# EAGLE design pCog101_Wifi_Remote_BLED (EAGLE 6.6.0)

## Sheet 1 of 5
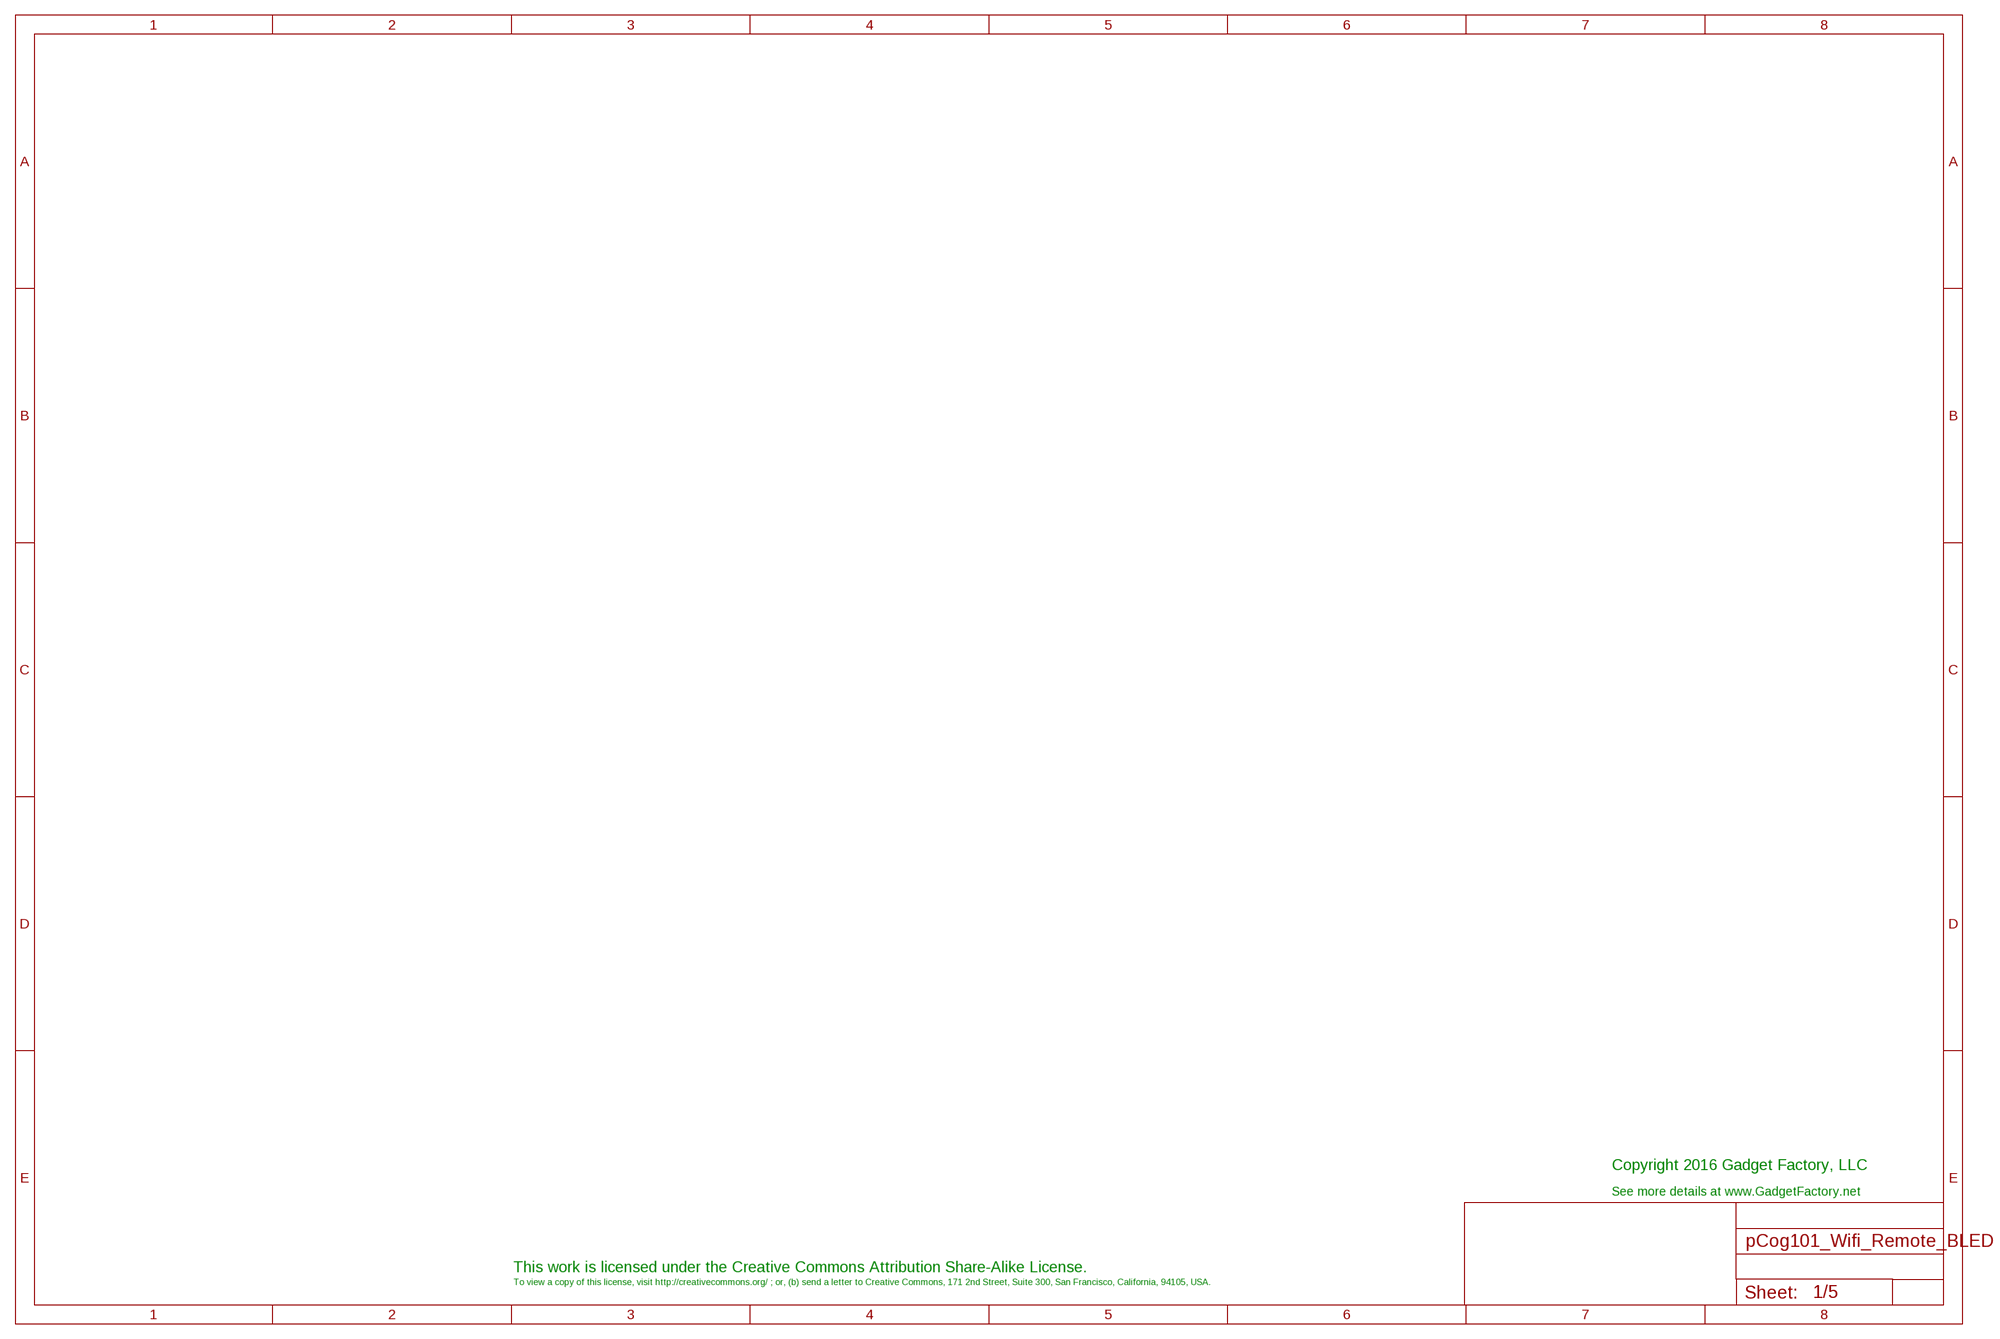
[diagram p0: schematic, sheet 1]

### Notes on the sheet
- Copyright 2016 Gadget Factory, LLC
- See more details at www.GadgetFactory.net
- This work is licensed under the Creative Commons Attribution Share-Alike License.
- To view a copy of this license, visit http://creativecommons.org/ ; or, (b) send a letter to Creative Commons, 171 2nd Street, Suite 300, San Francisco, California, 94105, USA.

## Sheet 2 of 5
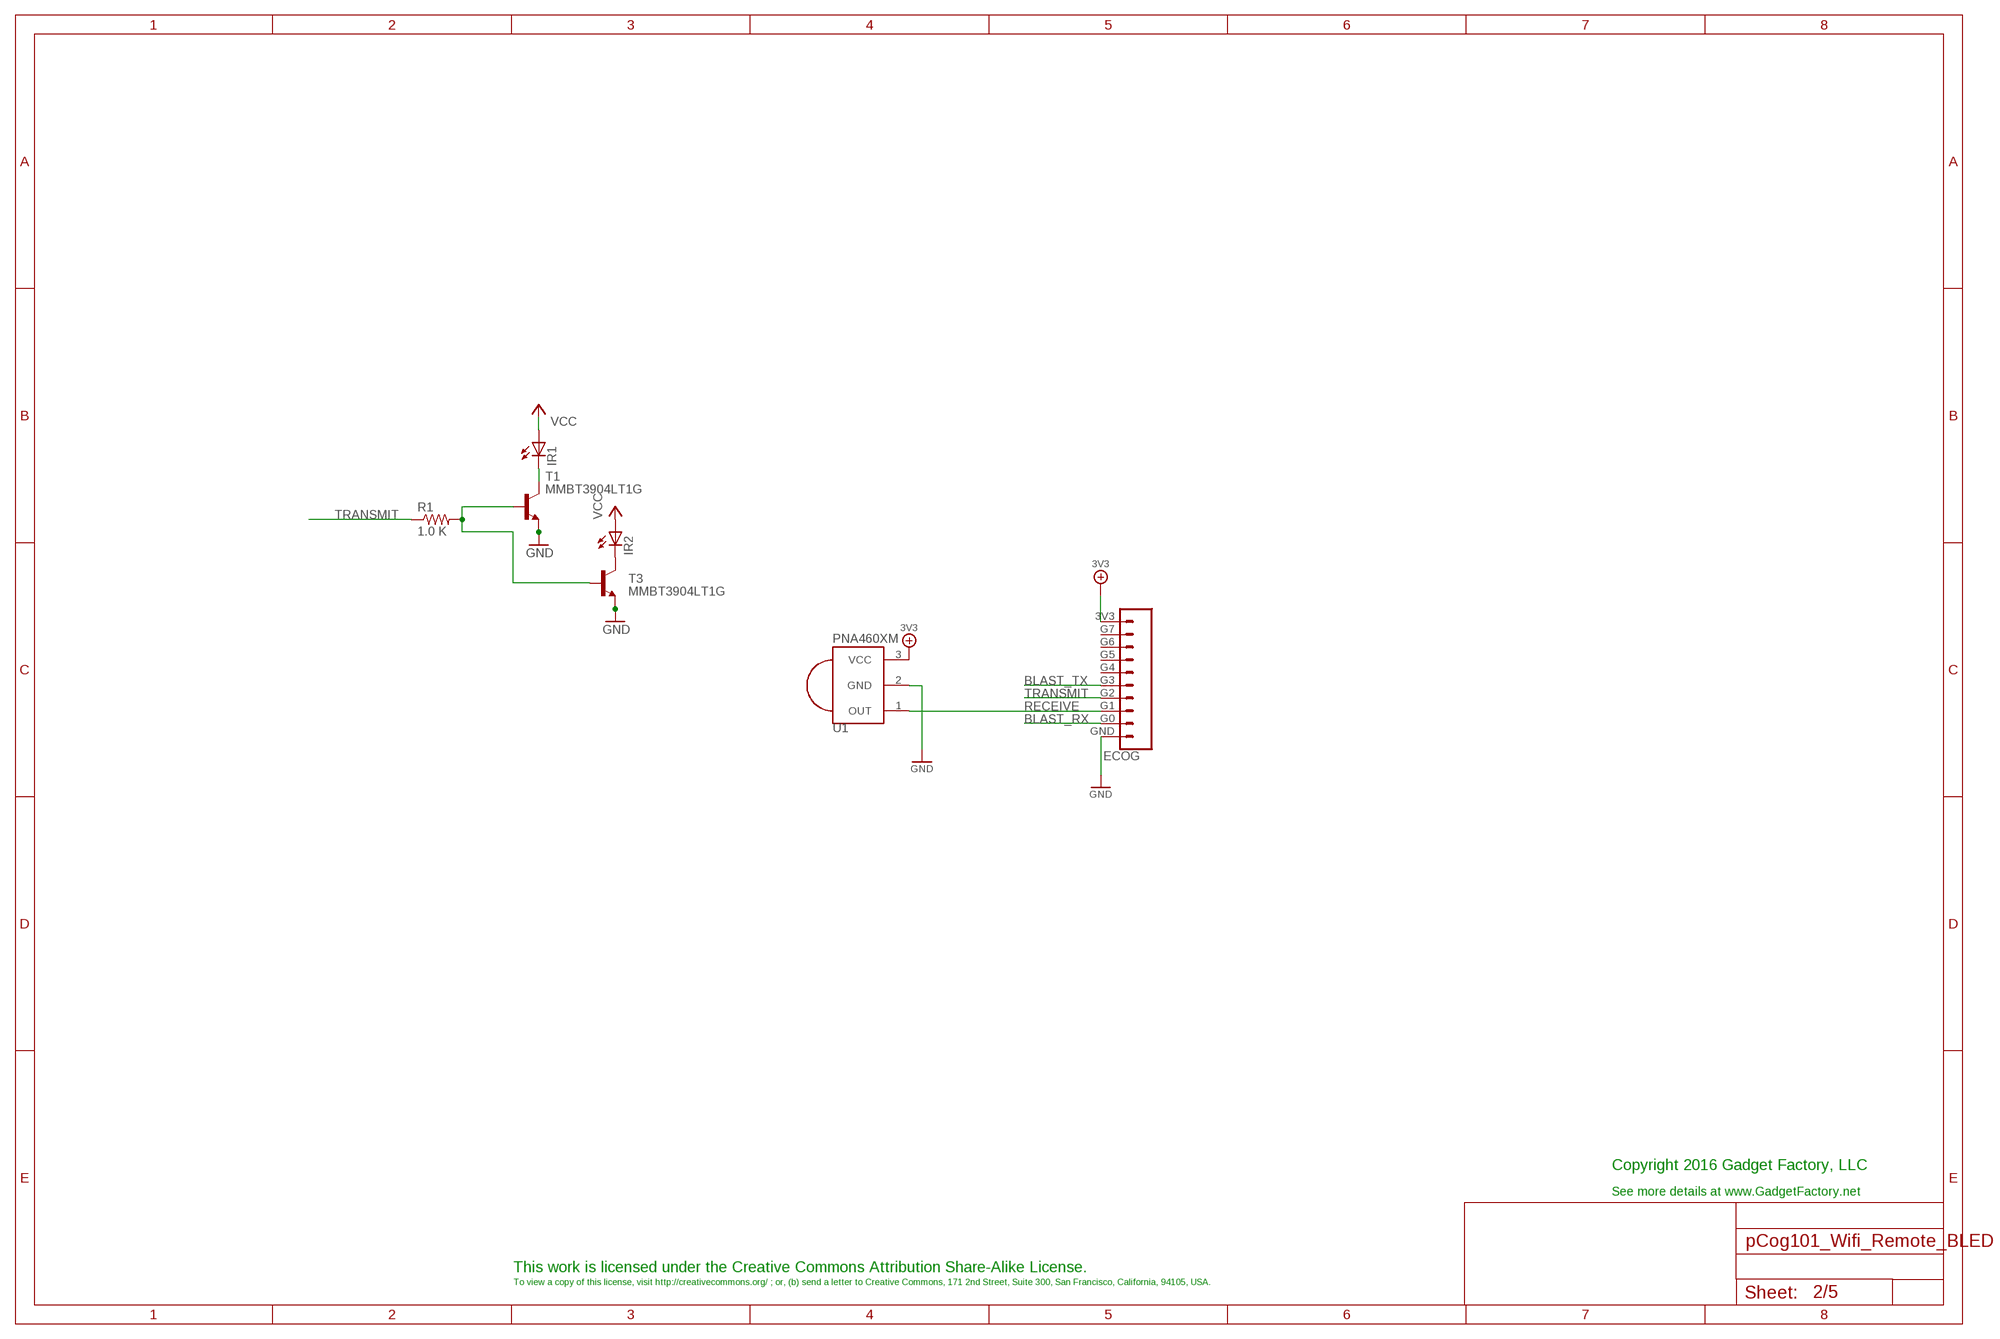
[diagram p1: schematic, sheet 2]

### Parts
ECOG  ECOG_GENERAL_ROWECOG_GENERAL_SMD  [ECOG_GENERAL_SMD]
IR1  LED5MM  [LED5MM]
IR2  LED5MM  [LED5MM]
R1  1.0 K  R-US_R0805  [R0805]
T1  MMBT3904LT1G  MMBT3904LT1-NPN-SOT23-BEC  [SOT23-BEC]
T3  MMBT3904LT1G  MMBT3904LT1-NPN-SOT23-BEC  [SOT23-BEC]
U1  PNA460XM  [PNA460XM]

### Nets
3V3: ECOG.3V3 IR1.A IR2.A U1.3(VCC) ; supply symbol labelled VCC ; also sheet 3,4,5
BLAST_RX: ECOG.G0
BLAST_TX: ECOG.G3
GND: ECOG.GND T1.E T3.E U1.2(GND) ; also sheet 3,4,5
N$7: IR1.K(C) T1.C
N$9: IR2.K(C) T3.C
N$10: R1.2 T1.B T3.B
RECEIVE: ECOG.G1 U1.1(OUT)
TRANSMIT: ECOG.G2 R1.1
Unconnected: ECOG.G4 ECOG.G5 ECOG.G6 ECOG.G7

### Notes on the sheet
- Copyright 2016 Gadget Factory, LLC
- See more details at www.GadgetFactory.net
- This work is licensed under the Creative Commons Attribution Share-Alike License.
- To view a copy of this license, visit http://creativecommons.org/ ; or, (b) send a letter to Creative Commons, 171 2nd Street, Suite 300, San Francisco, California, 94105, USA.

## Sheet 3 of 5
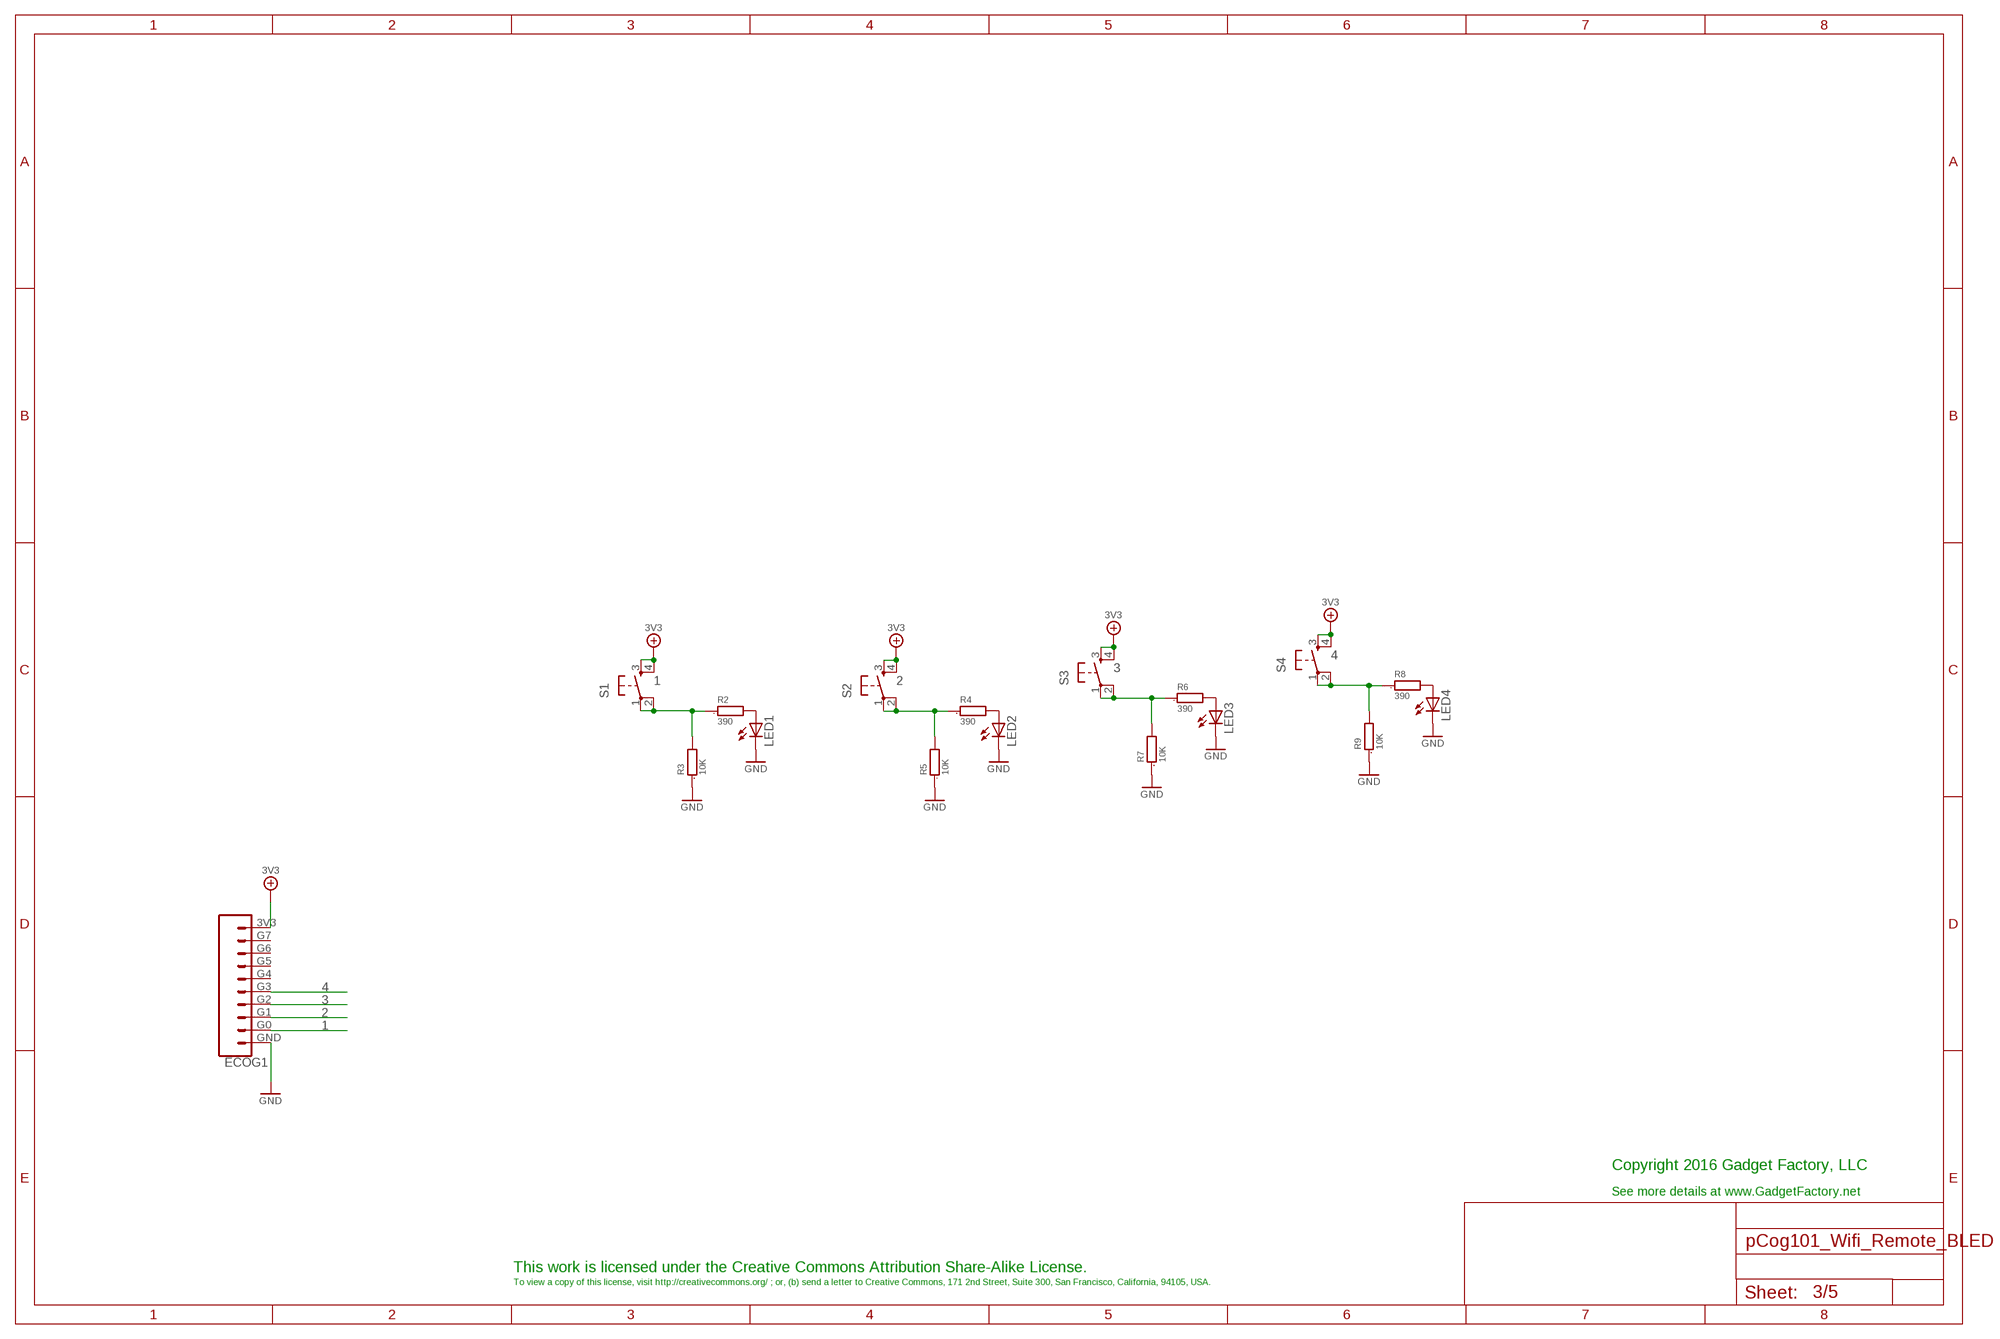
[diagram p2: schematic, sheet 3]

### Parts
ECOG1  ECOG_GENERAL_ROWECOG_GENERAL_SMD  [ECOG_GENERAL_SMD]
LED1  LEDCHIP-LED0805  [CHIP-LED0805]
LED2  LEDCHIP-LED0805  [CHIP-LED0805]
LED3  LEDCHIP-LED0805  [CHIP-LED0805]
LED4  LEDCHIP-LED0805  [CHIP-LED0805]
R2  390  R0805  [0805]
R3  10K  R0805  [0805]
R4  390  R0805  [0805]
R5  10K  R0805  [0805]
R6  390  R0805  [0805]
R7  10K  R0805  [0805]
R8  390  R0805  [0805]
R9  10K  R0805  [0805]
S1  TAC_SWITCHPTH  [TACTILE-PTH]
S2  TAC_SWITCHPTH  [TACTILE-PTH]
S3  TAC_SWITCHPTH  [TACTILE-PTH]
S4  TAC_SWITCHPTH  [TACTILE-PTH]

### Nets
1: ECOG1.G0 R2.1 R3.2 S1.1 S1.2
2: ECOG1.G1 R4.1 R5.2 S2.1 S2.2
3: ECOG1.G2 R6.1 R7.2 S3.1 S3.2
3V3: ECOG1.3V3 S1.3 S1.4 S2.3 S2.4 S3.3 S3.4 S4.3 S4.4 ; also sheet 2,4,5
4: ECOG1.G3 R8.1 R9.2 S4.1 S4.2
GND: ECOG1.GND LED1.C LED2.C LED3.C LED4.C R3.1 R5.1 R7.1 R9.1 ; also sheet 2,4,5
N$1: LED1.A R2.2
N$2: LED2.A R4.2
N$3: LED3.A R6.2
N$4: LED4.A R8.2
Unconnected: ECOG1.G4 ECOG1.G5 ECOG1.G6 ECOG1.G7

### Notes on the sheet
- Copyright 2016 Gadget Factory, LLC
- See more details at www.GadgetFactory.net
- This work is licensed under the Creative Commons Attribution Share-Alike License.
- To view a copy of this license, visit http://creativecommons.org/ ; or, (b) send a letter to Creative Commons, 171 2nd Street, Suite 300, San Francisco, California, 94105, USA.

## Sheet 4 of 5
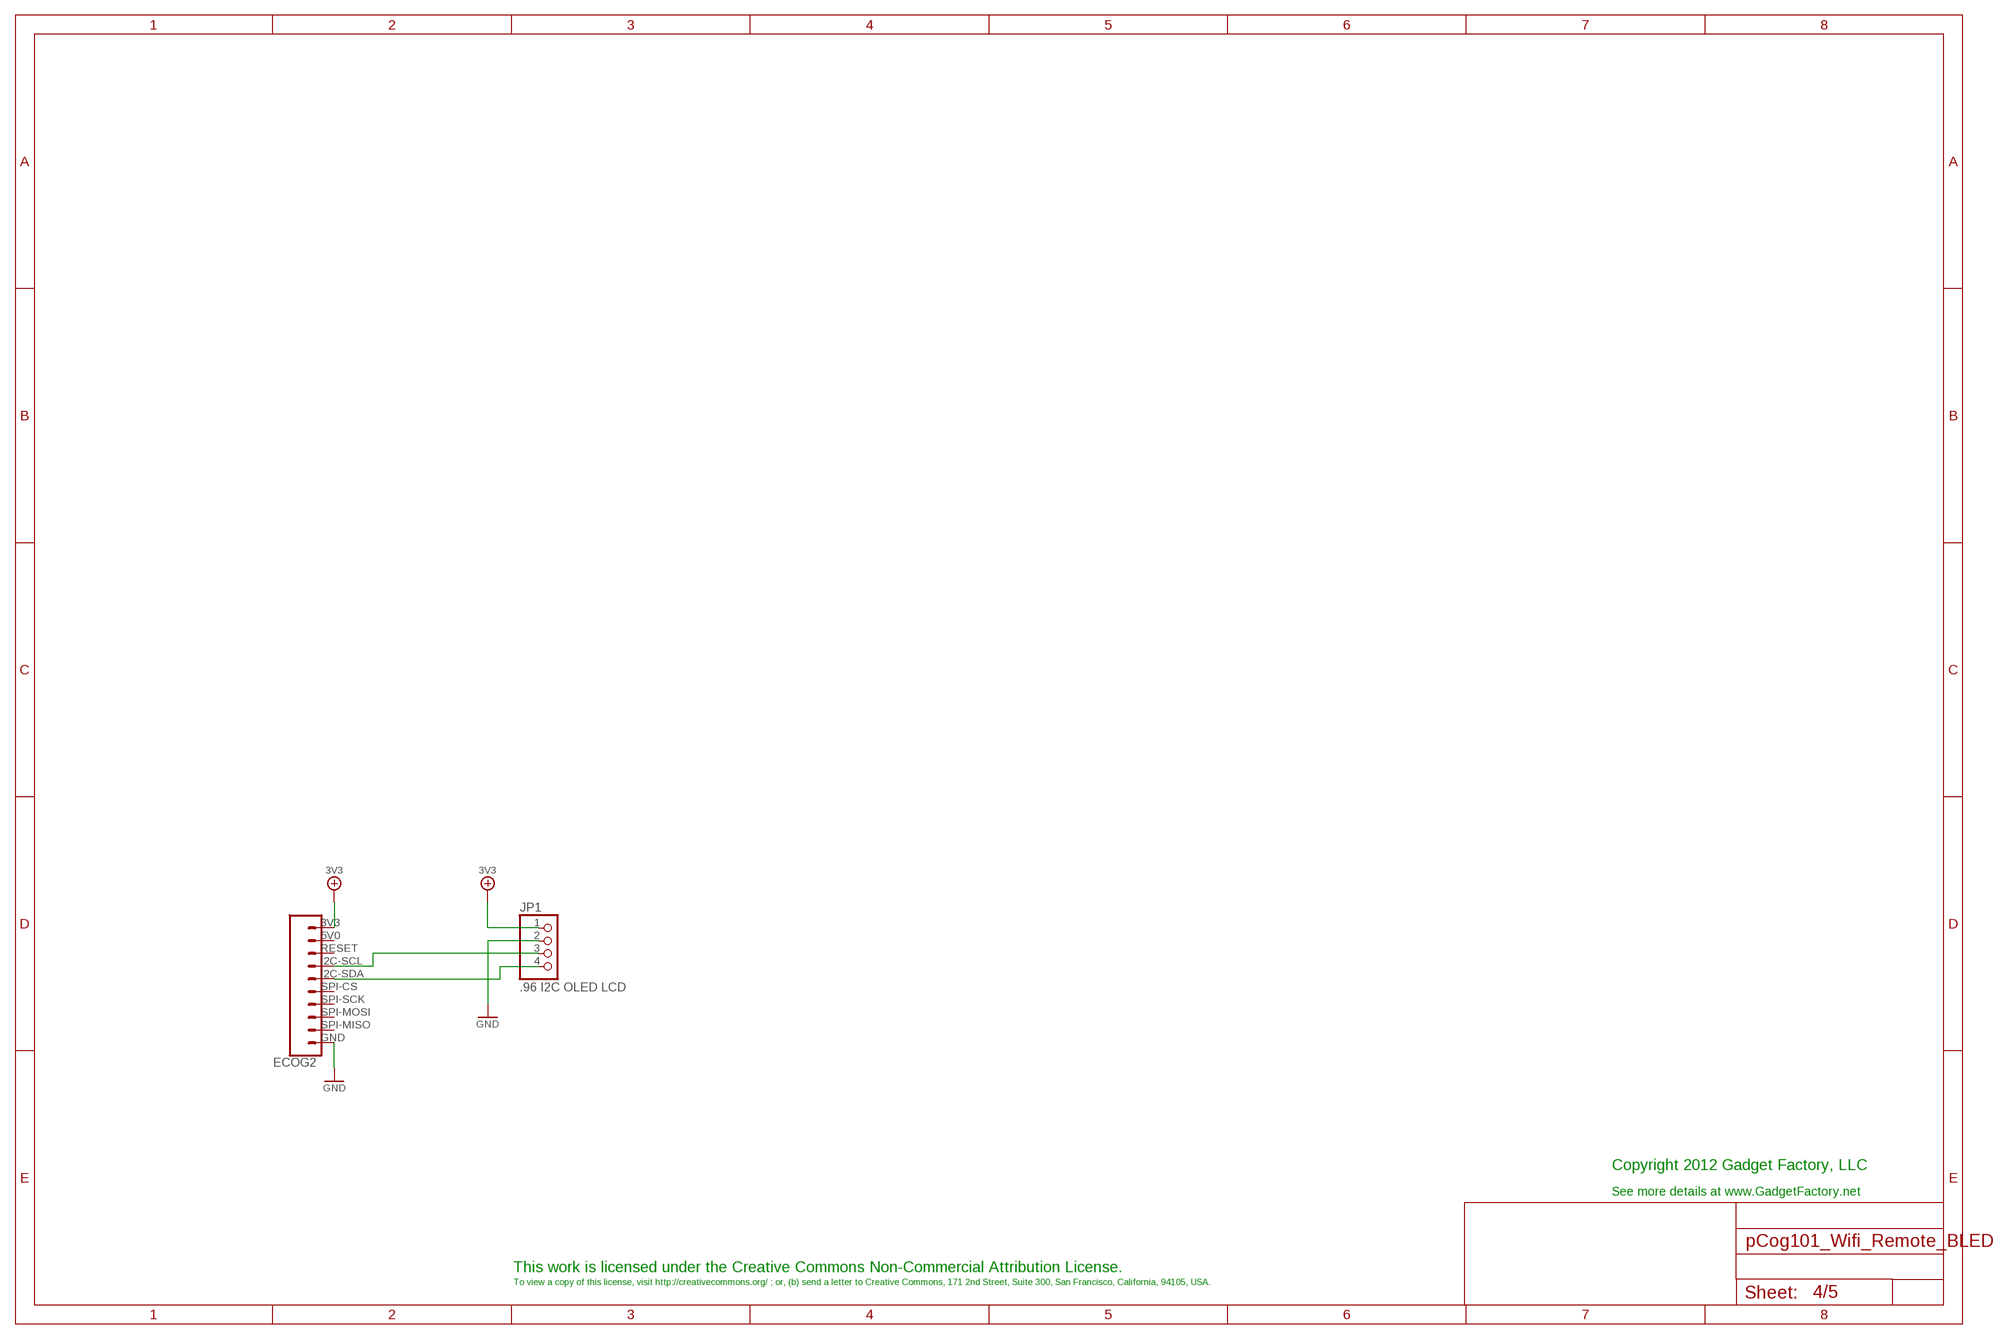
[diagram p3: schematic, sheet 4]

### Parts
ECOG2  ECOG_BUSES_ROWECOG_BUSES_SMD  [ECOG_BUSES_SMD]
JP1  .96 I2C OLED LCD  PINHD-1X4  [1X04]

### Nets
3V3: ECOG2.3V3 JP1.1 ; also sheet 2,3,5
GND: ECOG2.GND JP1.2 ; also sheet 2,3,5
N$5: ECOG2.I2C-SDA JP1.4
N$6: ECOG2.I2C-SCL JP1.3
Unconnected: ECOG2.5V0 ECOG2.RESET ECOG2.SPI-CS ECOG2.SPI-MISO ECOG2.SPI-MOSI ECOG2.SPI-SCK

### Notes on the sheet
- Copyright 2012 Gadget Factory, LLC
- See more details at www.GadgetFactory.net
- This work is licensed under the Creative Commons Non-Commercial Attribution License.
- To view a copy of this license, visit http://creativecommons.org/ ; or, (b) send a letter to Creative Commons, 171 2nd Street, Suite 300, San Francisco, California, 94105, USA.

## Sheet 5 of 5
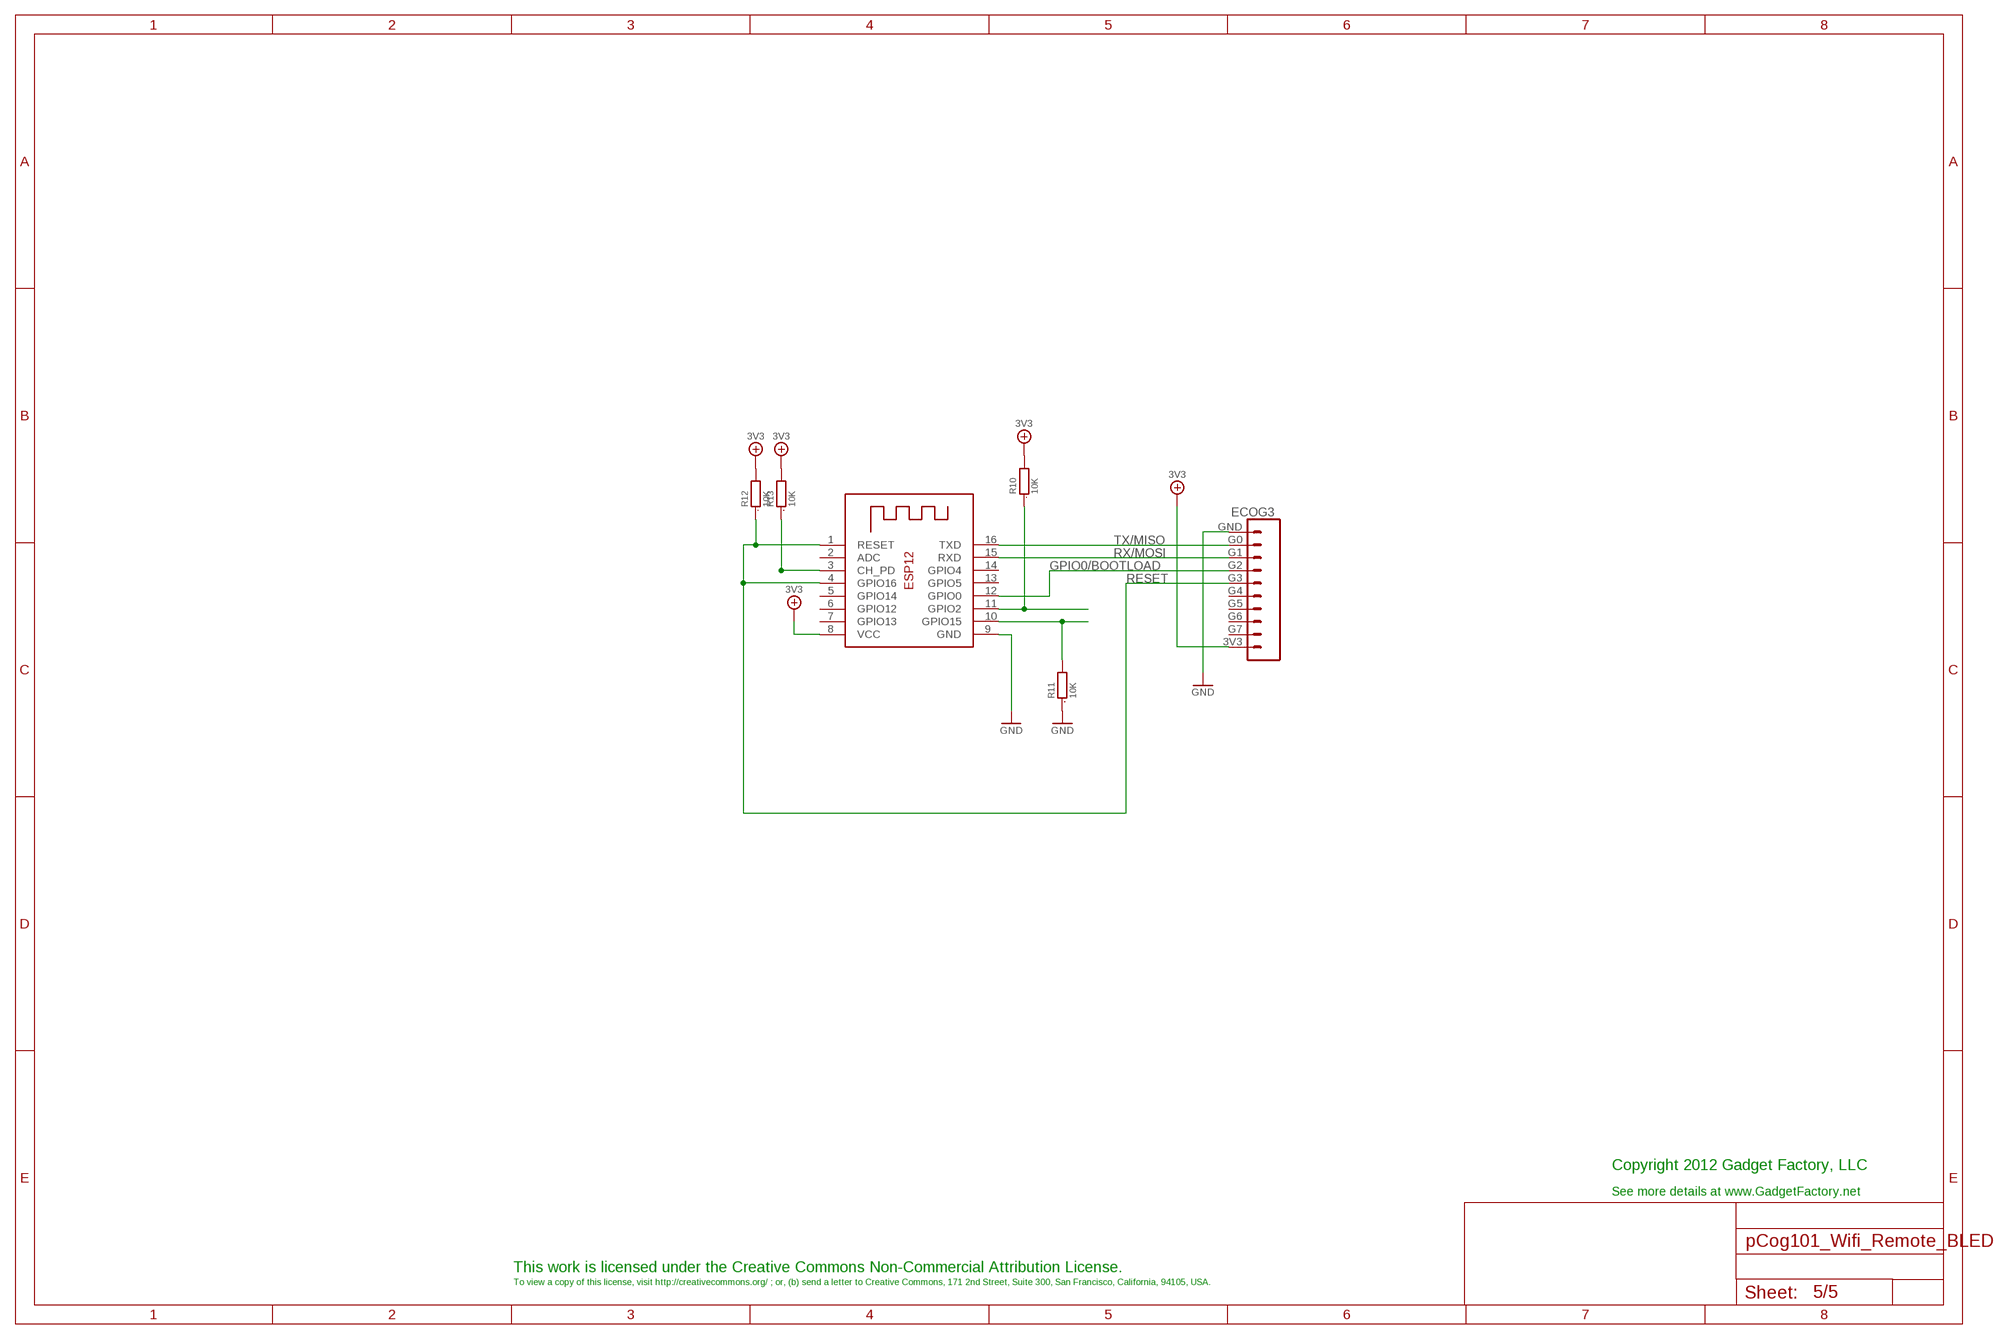
[diagram p4: schematic, sheet 5]

### Parts
ECOG3  ECOG_GENERAL_ROWECOG_GENERAL_SMD  [ECOG_GENERAL_SMD]
R10  10K  R0805  [0805]
R11  10K  R0805  [0805]
R12  10K  R0805  [0805]
R13  10K  R0805  [0805]
X1  ESP-12  [ESP-12]

### Nets
3V3: ECOG3.3V3 R10.2 R12.2 R13.2 X1.8(VCC) ; also sheet 2,3,4
GND: ECOG3.GND R11.1 X1.9(GND) ; also sheet 2,3,4
GPIO0/BOOTLOAD: ECOG3.G2 X1.12(GPIO0)
N$8: R10.1 X1.11(GPIO2)
N$11: R11.2 X1.10(GPIO15)
N$12: R13.1 X1.3(CH_PD)
RESET: ECOG3.G3 R12.1 X1.1(RESET) X1.4(GPIO16)
RX/MOSI: ECOG3.G1 X1.15(RXD)
TX/MISO: ECOG3.G0 X1.16(TXD)
Unconnected: ECOG3.G4 ECOG3.G5 ECOG3.G6 ECOG3.G7 X1.2(ADC) X1.5(GPIO14) X1.6(GPIO12) X1.7(GPIO13) X1.13(GPIO5) X1.14(GPIO4)

### Notes on the sheet
- Copyright 2012 Gadget Factory, LLC
- See more details at www.GadgetFactory.net
- This work is licensed under the Creative Commons Non-Commercial Attribution License.
- To view a copy of this license, visit http://creativecommons.org/ ; or, (b) send a letter to Creative Commons, 171 2nd Street, Suite 300, San Francisco, California, 94105, USA.

## Library data of the parts
ECOG ECOG1 ECOG3 = eCogs:ECOG_GENERAL_ROW; DIGIKEY: S1013EC-10-ND
ECOG2 = eCogs:ECOG_BUSES_ROW; DIGIKEY: S1013EC-10-ND
IR1 = adafruit:LED: LED OSRAM: - CHIPLED LG R971, LG N971, LY N971, LG Q971, LY Q971, LO R971, LY R971 LH N974, LH R974 LS Q976, LO Q976, LY Q976 LO Q996 - Hyper CHIPLED LW Q18S LB Q993, LB Q99A, LB R99A - SideLED LS A670, LO A670, LY A670, LG A670, LP A670 LB A673, LV A673, LT A673, LW A673 LH A674 LY A675 LS A676, LA A676, LO A676, LY A676, LW A676 LS A679, LY A679, LG A679 - Hyper Micro SIDELED® LS Y876, LA Y876, LO Y876, LY Y876 LT Y87S - SmartLED LW L88C, LW L88S LB L89C, LB L89S, LG L890 LS L89K, LO L89K, LY L89K LS L896, LA L896, LO L896, LY L896 - TOPLED LS T670, LO T670, LY T670, LG T670, LP T670 LSG T670, LSP T670, LSY T670, LOP T670, LYG T670 LG T671, LOG T671, LSG T671 LB T673, LV T673, LT T673, LW T673 LH T674 LS T676, LA T676, LO T676, LY T676, LB T676, LH T676, LSB T676, LW T676 LB T67C, LV T67C, LT T67C, LS T67K, LO T67K, LY T67K, LW E67C LS E67B, LA E67B, LO E67B, LY E67B, LB E67C, LV E67C, LT E67C LW T67C LS T679, LY T679, LG T679 LS T770, LO T770, LY T770, LG T770, LP T770 LB T773, LV T773, LT T773, LW T773 LH T774 LS E675, LA E675, LY E675, LS T675 LS T776, LA T776, LO T776, LY T776, LB T776 LHGB T686 LT T68C, LB T68C - Hyper Mini TOPLED® LB M676 - Mini TOPLED Santana® LG M470 LS M47K, LO M47K, LY M47K Source: http://www.osram.convergy.de/; DIGIKEY: 1080-1082-ND
IR2 = adafruit:LED: LED OSRAM: - CHIPLED LG R971, LG N971, LY N971, LG Q971, LY Q971, LO R971, LY R971 LH N974, LH R974 LS Q976, LO Q976, LY Q976 LO Q996 - Hyper CHIPLED LW Q18S LB Q993, LB Q99A, LB R99A - SideLED LS A670, LO A670, LY A670, LG A670, LP A670 LB A673, LV A673, LT A673, LW A673 LH A674 LY A675 LS A676, LA A676, LO A676, LY A676, LW A676 LS A679, LY A679, LG A679 - Hyper Micro SIDELED® LS Y876, LA Y876, LO Y876, LY Y876 LT Y87S - SmartLED LW L88C, LW L88S LB L89C, LB L89S, LG L890 LS L89K, LO L89K, LY L89K LS L896, LA L896, LO L896, LY L896 - TOPLED LS T670, LO T670, LY T670, LG T670, LP T670 LSG T670, LSP T670, LSY T670, LOP T670, LYG T670 LG T671, LOG T671, LSG T671 LB T673, LV T673, LT T673, LW T673 LH T674 LS T676, LA T676, LO T676, LY T676, LB T676, LH T676, LSB T676, LW T676 LB T67C, LV T67C, LT T67C, LS T67K, LO T67K, LY T67K, LW E67C LS E67B, LA E67B, LO E67B, LY E67B, LB E67C, LV E67C, LT E67C LW T67C LS T679, LY T679, LG T679 LS T770, LO T770, LY T770, LG T770, LP T770 LB T773, LV T773, LT T773, LW T773 LH T774 LS E675, LA E675, LY E675, LS T675 LS T776, LA T776, LO T776, LY T776, LB T776 LHGB T686 LT T68C, LB T68C - Hyper Mini TOPLED® LB M676 - Mini TOPLED Santana® LG M470 LS M47K, LO M47K, LY M47K Source: http://www.osram.convergy.de/; DIGIKEY: 1080-1080-ND
JP1 = pinhead:PINHD-1X4: PIN HEADER; DEALEXTREME: 419232
LED1-LED4 = adafruit:LED: LED OSRAM: - CHIPLED LG R971, LG N971, LY N971, LG Q971, LY Q971, LO R971, LY R971 LH N974, LH R974 LS Q976, LO Q976, LY Q976 LO Q996 - Hyper CHIPLED LW Q18S LB Q993, LB Q99A, LB R99A - SideLED LS A670, LO A670, LY A670, LG A670, LP A670 LB A673, LV A673, LT A673, LW A673 LH A674 LY A675 LS A676, LA A676, LO A676, LY A676, LW A676 LS A679, LY A679, LG A679 - Hyper Micro SIDELED® LS Y876, LA Y876, LO Y876, LY Y876 LT Y87S - SmartLED LW L88C, LW L88S LB L89C, LB L89S, LG L890 LS L89K, LO L89K, LY L89K LS L896, LA L896, LO L896, LY L896 - TOPLED LS T670, LO T670, LY T670, LG T670, LP T670 LSG T670, LSP T670, LSY T670, LOP T670, LYG T670 LG T671, LOG T671, LSG T671 LB T673, LV T673, LT T673, LW T673 LH T674 LS T676, LA T676, LO T676, LY T676, LB T676, LH T676, LSB T676, LW T676 LB T67C, LV T67C, LT T67C, LS T67K, LO T67K, LY T67K, LW E67C LS E67B, LA E67B, LO E67B, LY E67B, LB E67C, LV E67C, LT E67C LW T67C LS T679, LY T679, LG T679 LS T770, LO T770, LY T770, LG T770, LP T770 LB T773, LV T773, LT T773, LW T773 LH T774 LS E675, LA E675, LY E675, LS T675 LS T776, LA T776, LO T776, LY T776, LB T776 LHGB T686 LT T68C, LB T68C - Hyper Mini TOPLED® LB M676 - Mini TOPLED Santana® LG M470 LS M47K, LO M47K, LY M47K Source: http://www.osram.convergy.de/; DIGIKEY: 475-1410-2-ND
R1 = rcl-ez:R-US_: RESISTOR, American symbol; DIGIKEY: 311-1.0KARCT-ND
R2 R4 R6 R8 = GadgetFactory:R: RESISTOR, European symbol; DIGIKEY: RMCF0805JT390RCT-ND
R3 R5 R7 R9-R13 = GadgetFactory:R: RESISTOR, European symbol; DIGIKEY: RMCF0805JT10K0CT-ND
S1-S4 = SparkFun:TAC_SWITCH: Momentary Switch Button commonly used for reset or general input. Spark Fun Electronics SKU : COM-00097; DIGIKEY: 679-2428-ND
T1 T3 = transistor:*-NPN-: NPN Transistror BF959 corrected 2008.03.06; DIGIKEY: MMBT3904LT1GOSCT-ND
U1 = adafruit:PNA460XM: IR 38KHz receiver PNA4602 and related receivers http://www.ladyada.net/library/pcb/eaglelibrary.html; DIGIKEY: 751-1227-ND
X1 = adafruit:ESP-12; ADAFRUIT: 2491

## Board
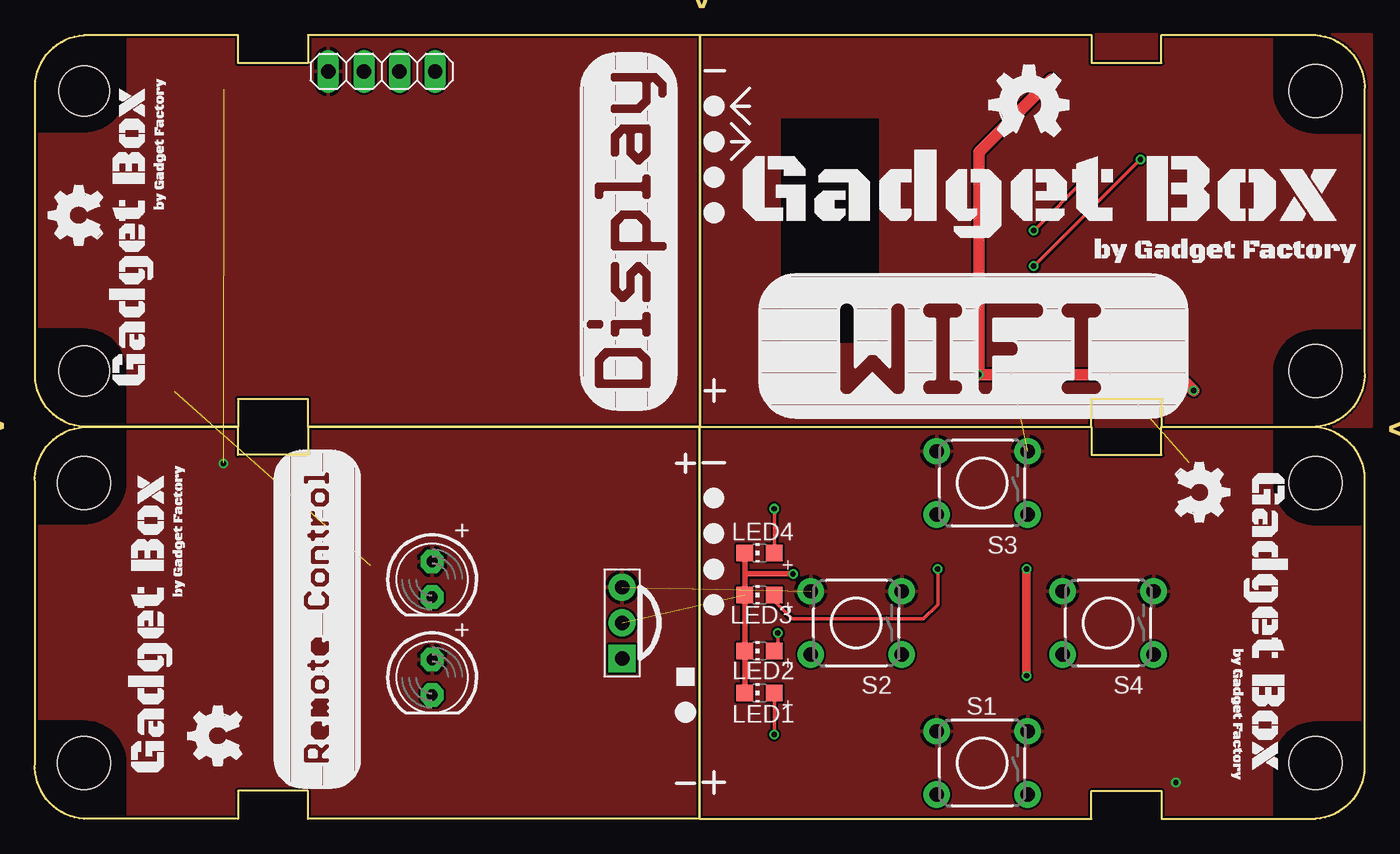
[diagram p5: board, top side]
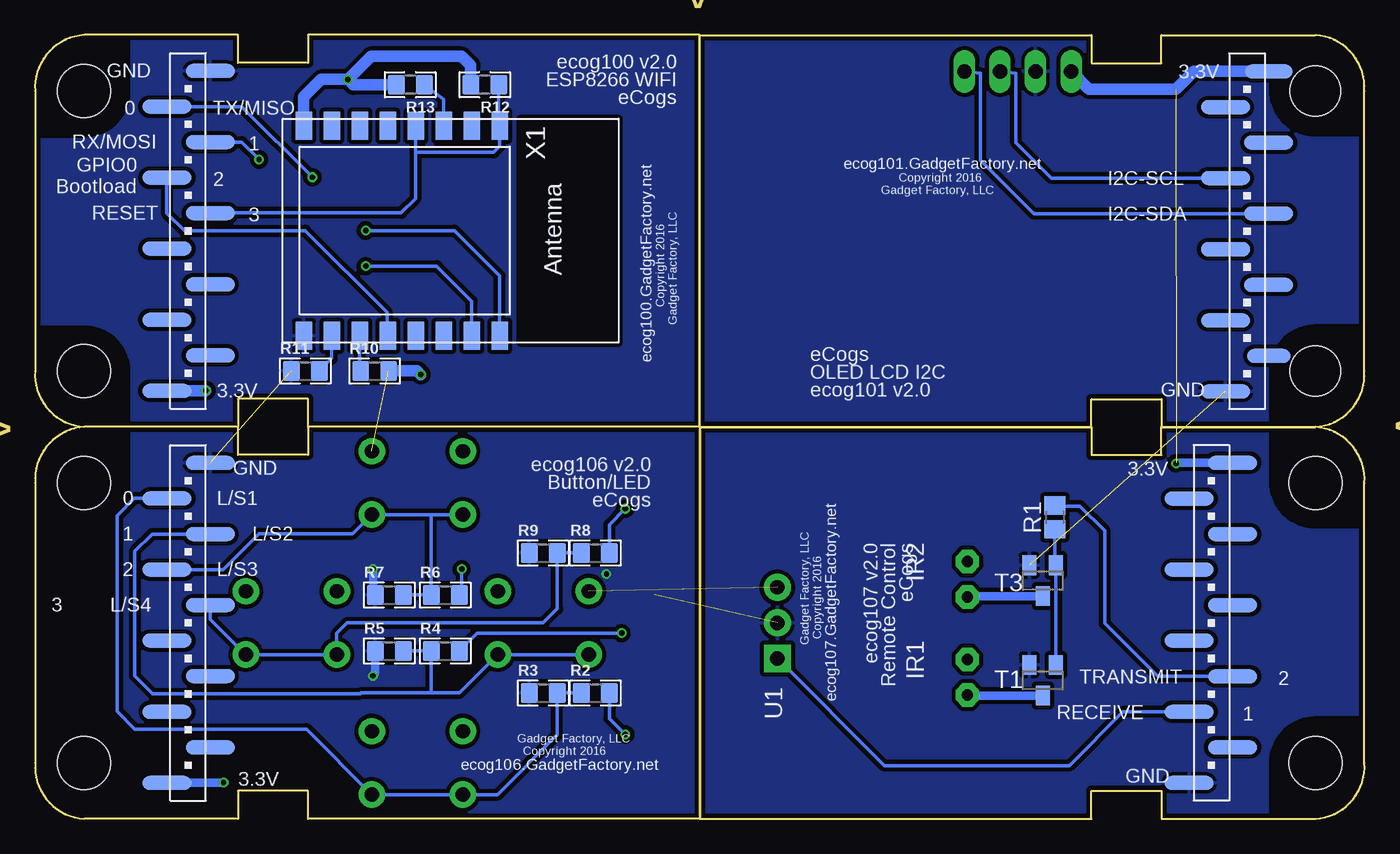
[diagram p6: board, bottom side, seen from below]

Size 95.02 x 56 mm. Coordinates in mm from the lower left corner, seen from the top.
Copper layers (1*16): Top 0.035mm / dielectric 1.5mm / Bottom 0.035mm
Design rules "hackvana": minimum track width 6mil, minimum drill 0.3mm, track to track 6mil, track to pad 6mil, pad to pad 6mil, via to via 6mil, smd to smd 0mil, copper to edge 6mil, drill to drill 6mil, minimum pad ring 10mil, minimum via ring 6mil, stop-mask expansion 2mil, vias tented up to drill 100mil, thermal gap 10mil

### Footprints (pad centres in the part's own frame; a part is rotated, then mirrored left to right if it is on the bottom)
ECOG_GENERAL_SMD = smd 3.5 x 1 bottom: 3V3 9.923,25.429; G0 9.923,5.111; G1 13.022,7.649; G2 9.923,10.189; G3 13.022,12.729; G4 9.923,15.269; G5 13.022,17.809; G6 9.923,20.349; G7 13.022,22.889; GND 13.022,2.571 | hole 3.8: 4,24; 4,4
ECOG_BUSES_SMD = smd 3.4 x 1 bottom: 3V3 7.337,25.4 | smd 3.5 x 1 bottom: 5V0 10.436,22.86; GND 10.436,2.54; I2C-SCL 10.436,17.78; I2C-SDA 7.337,15.24; RESET 7.337,20.32; SPI-CS 10.436,12.7; SPI-MOSI 10.436,7.62; SPI-SCK 7.337,10.16 | smd 3.1 x 1 bottom: SPI-MISO 7.337,5.08 | hole 3.6: 4.004,24.003; 4.004,4.003
LED5MM = drill 0.813 pad 1.676 octagon: A -1.27,0; K 1.27,0
1X04 = drill 1.016 long: 1 -3.81,0; 2 -1.27,0; 3 1.27,0; 4 3.81,0
CHIP-LED0805 = smd 1.2 x 1.2: A 0,-1.05; C 0,1.05
R0805 = smd 1.3 x 1.5: 1 -0.85,0; 2 0.85,0
0805 = smd 1.2 x 1.4: 1 -1,0; 2 1,0
TACTILE-PTH = drill 1.016 pad 1.88: 1 -3.251,2.261; 2 3.251,2.261; 3 -3.251,-2.261; 4 3.251,-2.261
SOT23-BEC = smd 1 x 1.4: B -0.95,-1.1; C 0,1.1; E 0.95,-1.1
PNA460XM = drill 1.016 pad 1.93 square: 1 -2.54,0 | drill 1.016 pad 1.93: 2 0,0; 3 2.54,0
ESP-12 = smd 2 x 1.2: 1 -7.5,4.5; 2 -7.5,2.5; 3 -7.5,0.5; 4 -7.5,-1.5; 5 -7.5,-3.5; 6 -7.5,-5.5; 7 -7.5,-7.5; 8 -7.5,-9.5; 9 7.5,-9.5; 10 7.5,-7.5; 11 7.5,-5.5; 12 7.5,-3.5; 13 7.5,-1.5; 14 7.5,0.5; 15 7.5,2.5; 16 7.5,4.5

### Placement (x,y rotation side)
ECOG  -0.49,0 0 top
ECOG1  95.5,28 180 top
ECOG2  -0.5,28 0 top
ECOG3  95.51,56 180 top
IR1  28.38,10.11 270 top
IR2  28.38,17.11 270 top
JP1  24.77,53.4 0 top
LED1  51.77,9 90 top
LED2  51.77,12 90 top
LED3  51.77,16 90 top
LED4  51.77,19 90 top
R1  22.13,21.54 270 bottom
R2  54.96,9 0 bottom
R3  58.69,9 0 bottom
R4  65.69,12 0 bottom
R5  69.69,12 0 bottom
R6  65.69,16 0 bottom
R7  69.69,16 0 bottom
R8  54.96,19 0 bottom
R9  58.69,19 0 bottom
R10  70.74,32 0 bottom
R11  75.7,32 0 bottom
R12  62.87,52.45 180 bottom
R13  68.2,52.45 180 bottom
S1  67.69,4 180 top
S2  58.69,14 180 top
S3  67.69,24 180 top
S4  76.69,14 180 top
T1  23,9.91 180 bottom
T3  23,17.02 180 bottom
U1  41.97,14 90 top
U$1  [LEGEND_DIO]  48.51,15.3 180 top
U$2  [LEGEND_PWM]  46.5,10.16 0 top
U$3  [LEGEND_DIO]  48.51,17.84 180 top
U$4  [LEGEND_DIO]  46.5,7.62 0 top
U$5  [GADGETBOX_SMALL]  8.3,14 90 top
U$6  [OSHW_FILLX150_NOTEXT]  14.75,3.81 90 top
U$7  [LEGEND_DIO]  48.51,20.38 180 top
U$8  [LEGEND_DIO]  48.51,22.92 180 top
U$9  [GADGETBOX_SMALL]  87.88,14.03 270 top
U$10  [OSHW_FILLX150_NOTEXT]  81.53,25.46 270 top
U$11  [GADGETBOX_SMALL]  6.95,41.65 90 top
U$12  [OSHW_FILLX150_NOTEXT]  4.8,41 90 top
U$13  [GADGETBOX_TEXT]  71.89,44.45 0 top
U$14  [LEGEND_DIO]  48.52,43.3 180 top
U$15  [LEGEND_DIO]  48.52,45.84 180 top
U$16  [LEGEND_DIO]  48.52,48.38 180 top
U$17  [LEGEND_DIO]  48.52,50.92 180 top
U$18  [OSHW_FILLX200_NOTEXT]  68.2,48.76 0 top
X1  66.3,42.03 270 bottom

### Tracks (layer width: path | path; a pad name or v marks a point on that pad's centre or on a via)
1
  Bottom 0.254: R2.1 R3.2 57.69,6 61.96,1.74 S1.2 S1.1 75.62,6.41 87.88,6.41 89.15,7.68 89.15,21.65 87.92,22.89 ECOG1.G0
2
  Bottom 0.254: R5.2 R4.1 66.69,9 | 66.69,9 71.69,9 71.74,8.95 86.61,8.95 87.88,10.22 87.88,19.11 86.64,20.35 ECOG1.G1 | 66.69,9 64.69,9 S2.1 S2.2
3
  Bottom 0.254: R7.2 R6.1 66.69,21.74 | S3.2 66.69,21.74 | 66.69,21.74 S3.1 72.31,20.38 78.99,20.38 81.56,17.81 ECOG1.G2
3V3  (via drill 0.38)  (3 unrouted)
  Top 0.813: v72.65,52.83 67.44,47.62 v67.44,31.75 81.67,31.75 v82.81,30.6
  Bottom 0.61: ECOG.3V3 13.45,25.43 v13.48,25.4 | ECOG1.3V3 81.56,2.57 v81.53,2.6
  Bottom 0.813: ECOG2.3V3 12.21,53.4 13.48,52.13 19.7,52.13 JP1.1 | 75.89,49.62 X1.8 75.8,51.58 74.55,52.83 v72.65,52.83 | R13.2 72.27,52.45 v72.65,52.83 | R12.2 63.87,53.83 64.52,54.48 71,54.48 v72.65,52.83 | R10.2 67.7,32 v67.44,31.75 | v82.81,30.6 85.56,30.6 ECOG3.3V3
  pour Top: -1.49,29 48.51,29 48.51,-1 -1.49,-1
  pour Top: 96.5,-1 46.5,-1 46.5,29 96.5,29
  pour Top: -1.77,57.27 48.77,57.27 48.77,26.73 -1.77,26.73
4
  Bottom 0.254: R8.1 R9.2 57.69,15 58.69,14 72.69,14 73.44,13.25 S4.2 S4.1 82.48,14.28 ECOG1.G3
GND  (via drill 0.38)  (3 unrouted)
  Top 0.406: LED1.C LED2.C LED3.C 50.72,17.52 | 50.72,17.52 LED4.C | 50.72,17.52 54.16,17.52 v54.17,17.5
  Top 0.61: v70.87,10.22 v70.87,17.84
  Bottom 0.61: R5.1 70.69,10.39 v70.87,10.22 | v70.87,17.84 70.87,16.17 R7.1
  pour Bottom (isolate 0.305): -2.49,30 49.51,30 49.51,-2 -2.49,-2
  pour Bottom (isolate 0.305): 97.5,-2 45.5,-2 45.5,30 97.5,30
  pour Bottom (isolate 0.305): -3.04,58.54 50.04,58.54 50.04,25.46 -3.04,25.46
  pour Bottom (isolate 0.305): 95.51,28 47.51,28 47.51,56 95.51,56
  pour Top: 95.51,28.06 47.25,28.06 47.25,56 95.51,56
GPIO0/BOOTLOAD
  Bottom 0.254: X1.12 69.85,34.59 69.85,36.19 75.7,42.03 84.33,42.03 85.59,43.28 ECOG3.G2
N$1  (via drill 0.38)
  Top 0.254: v52.83,6.03 LED1.A
  Bottom 0.254: R2.2 53.96,7.16 v52.83,6.03
N$2  (via drill 0.38)
  Top 0.254: v53.09,13.27 53.09,12.26 LED2.A
  Bottom 0.254: v53.09,13.27 63.43,13.27 R4.2
N$3  (via drill 0.38)
  Top 0.254: LED3.A 52.39,16 54.1,14.29 63.5,14.29 64.52,15.3 v64.52,17.84
  Bottom 0.254: v64.52,17.84 64.52,16.18 R6.2
N$4  (via drill 0.38)
  Top 0.254: v52.83,22.16 LED4.A
  Bottom 0.254: R8.2 53.96,21.03 v52.83,22.16
N$5
  Bottom 0.254: ECOG2.I2C-SDA 23.64,43.24 27.45,47.05 27.45,53.27 JP1.4
N$6
  Bottom 0.254: ECOG2.I2C-SCL 22.37,45.78 24.91,48.32 24.91,53.27 JP1.3
N$7
  Bottom 0.61: T1.C 28.34,8.81 IR1.K
N$8
  Bottom 0.254: X1.11 71.8,32.05 R10.1
N$9
  Bottom 0.61: T3.C 28.3,15.92 IR2.K
N$10
  Bottom 0.254: R1.2 22.13,18.2 T3.B T1.B
N$11
  Bottom 0.254: X1.10 73.8,32.9 R11.2
N$12
  Bottom 0.254: X1.3 65.8,51.42 R13.1
RECEIVE
  Bottom 0.254: ECOG.G1 17.26,7.65 21.1,3.81 34.32,3.81 U1.1
RESET
  Bottom 0.254: 67.82,47.62 67.82,49.51 X1.4 | R12.1 61.87,49.6 X1.1 61.8,48.06 62.23,47.62 67.82,47.62 | 67.82,47.62 67.82,44.32 68.84,43.3 82.46,43.3 ECOG3.G3
RX/MOSI  (via drill 0.38)
  Top 0.254: v79,47.11 v71.38,39.49
  Bottom 0.254: 63.76,34.49 X1.15 63.8,36.99 66.3,39.49 v71.38,39.49 | ECOG3.G1 80.24,48.35 v79,47.11
TRANSMIT
  Bottom 0.254: ECOG.G2 14.78,10.19 18.56,13.97 18.56,20.57 20.34,22.35 22.09,22.35 R1.1
TX/MISO  (via drill 0.38)
  Top 0.254: v75.19,45.84 v71.38,42.03
  Bottom 0.254: 61.98,34.35 X1.16 61.8,38.8 65.03,42.03 v71.38,42.03 | ECOG3.G0 80.24,50.89 v75.19,45.84

### Text on the board
Dimension: <----vScore | vScore----> | <----vScore | vScore---->
tPlace: + | +
bPlace: ecog100 v2.0 | GND | 3.3V | ESP8266 WIFI | eCogs | TX/MISO | 0 | 1 | RX/MOSI | GPIO0 / Bootload | Copyright 2016 | ecog101.GadgetFactory.net | 2 | I2C-SCL | Gadget Factory, LLC | 3 | RESET | I2C-SDA | Copyright 2016 | Gadget Factory, LLC | eCogs | ecog100.GadgetFactory.net | OLED LCD I2C | 3.3V | GND | ecog101 v2.0 | ecog106 v2.0 | GND | 3.3V | Button/LED | ecog107.GadgetFactory.net | eCogs | L/S1 | 0 | Gadget Factory, LLC | L/S2 | 1 | eCogs | Remote Control | ecog107 v2.0 | Copyright 2016 | L/S3 | 2 | L/S4 | 3 | 2 | TRANSMIT | 1 | RECEIVE | Gadget Factory, LLC | Copyright 2016 | ecog106.GadgetFactory.net | GND | 3.3V